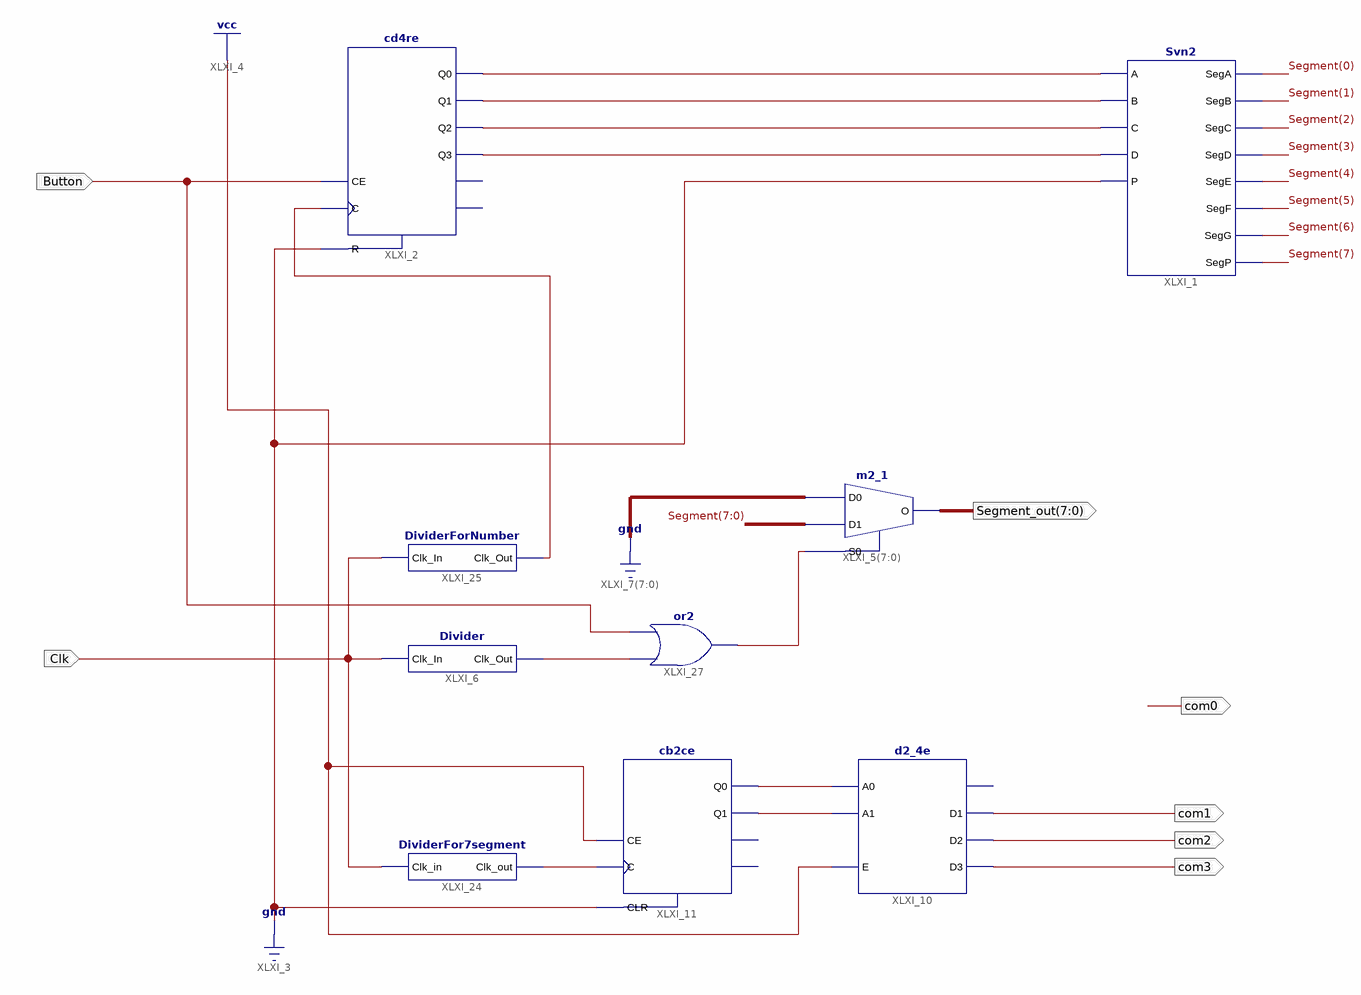
[diagram p0: schematic sheet 1]
// Xilinx ISE schematic TestProject.sch (spartan6) as structural Verilog: 9 symbols, 7 ports
module TestProject (
  input  Button,
  input  Clk,
  output [7:0] Segment_out,
  output com3,
  output com2,
  output com1,
  output com0
);

  wire XLXN_30, XLXN_31, XLXN_62, XLXN_114, XLXN_115, XLXN_117, XLXN_148, XLXN_149, XLXN_150, XLXN_151;
  wire [7:0] Segment;

  cd4re XLXI_2 (
    .C(XLXN_114), .CE(Button), .R(1'b0), .Q0(XLXN_148), .Q1(XLXN_149), .Q2(XLXN_150), .Q3(XLXN_151));  // open: CEO, TC
  m2_1 XLXI_5[7:0] (.D0({8{1'b0}}), .D1(Segment), .S0(XLXN_115), .O(Segment_out));
  Divider XLXI_6 (.Clk_In(Clk), .Clk_Out(XLXN_117));
  d2_4e XLXI_10 (.A0(XLXN_30), .A1(XLXN_31), .E(1'b1), .D1(com1), .D2(com2), .D3(com3));  // open: D0
  cb2ce XLXI_11 (.C(XLXN_62), .CE(1'b1), .CLR(1'b0), .Q0(XLXN_30), .Q1(XLXN_31));  // open: CEO, TC
  DividerFor7segment XLXI_24 (.Clk_in(Clk), .Clk_out(XLXN_62));
  DividerForNumber XLXI_25 (.Clk_In(Clk), .Clk_Out(XLXN_114));
  or XLXI_27 (XLXN_115, XLXN_117, Button);
  Svn2 XLXI_1 (
    .A(XLXN_148), .B(XLXN_149), .C(XLXN_150), .D(XLXN_151), .P(1'b0), .SegA(Segment[0]), .SegB(Segment[1]),
    .SegC(Segment[2]), .SegD(Segment[3]), .SegE(Segment[4]), .SegF(Segment[5]), .SegG(Segment[6]),
    .SegP(Segment[7]));

  // Notes on the sheet:
  //   CLOCK_DEDICATED_ROUTE on signal Button = FALSE
endmodule
